# EAGLE design 03-LiDAR (EAGLE 9.6.2)

## Sheet 1 of 3
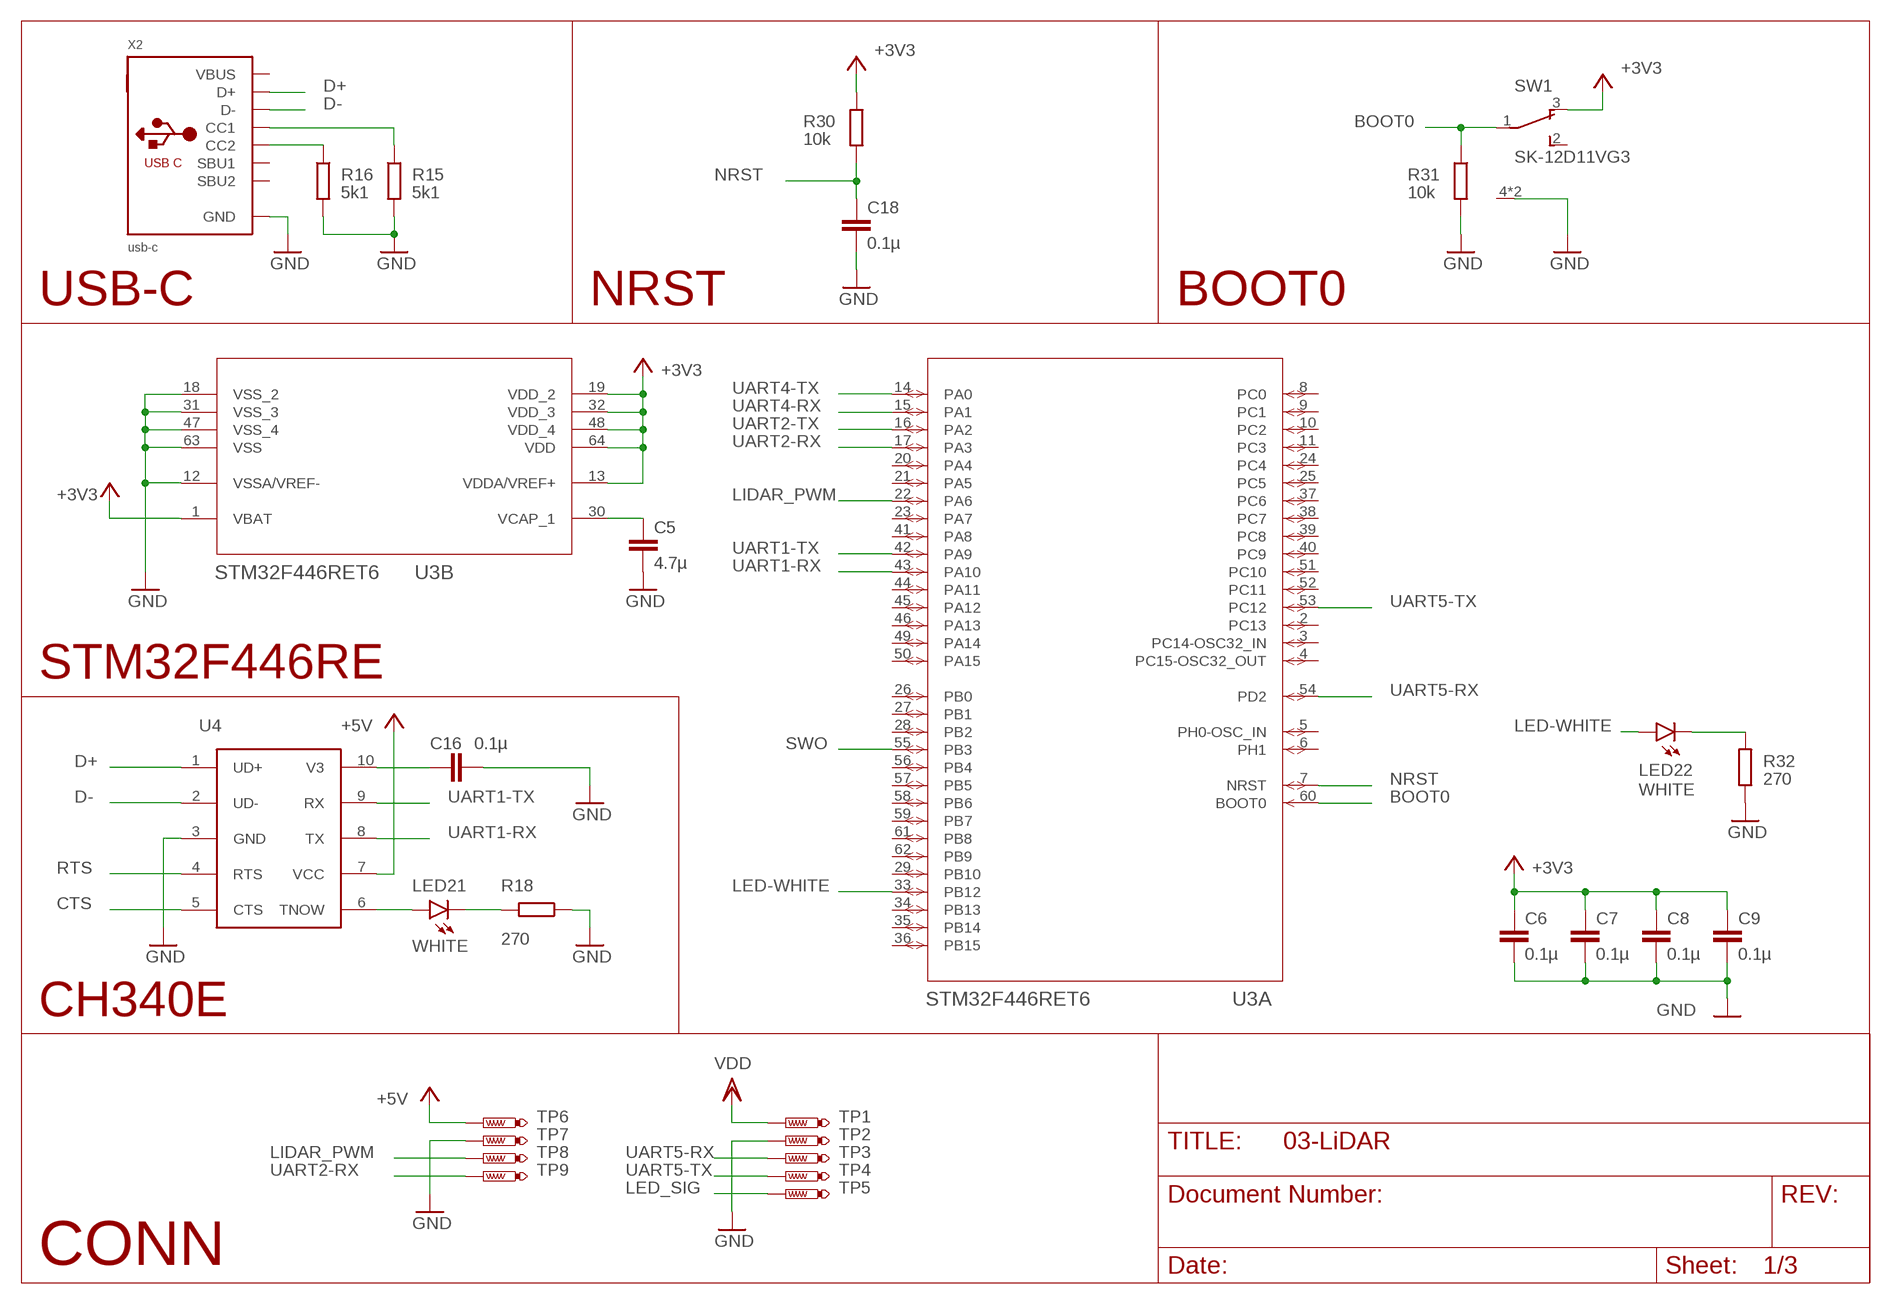
[diagram p0: schematic, sheet 1]

### Parts
C5  4.7µ  C-EUC0603  [C0603]
C6  0.1µ  C-EUC0603  [C0603]
C7  0.1µ  C-EUC0603  [C0603]
C8  0.1µ  C-EUC0603  [C0603]
C9  0.1µ  C-EUC0603  [C0603]
C16  0.1µ  C-EUC0603  [C0603]
C18  0.1µ  C-EUC0603  [C0603]
LED21  WHITE  LEDSML0603  [SML0603]
LED22  WHITE  LEDSML0603  [SML0603]
R15  5k1  R-EU_R0402  [R0402]
R16  5k1  R-EU_R0402  [R0402]
R18  270  R-EU_R0402  [R0402]
R30  10k  R-EU_R0402  [R0402]
R31  10k  R-EU_R0402  [R0402]
R32  270  R-EU_R0402  [R0402]
SW1  SK-12D11VG3  [SK-12D11VG3]
TP1  PTR1TP10R  [TP10R]
TP2  PTR1TP10SQ  [TP10SQ]
TP3  PTR1TP10R  [TP10R]
TP4  PTR1TP10R  [TP10R]
TP5  PTR1TP10R  [TP10R]
TP6  PTR1TP10R  [TP10R]
TP7  PTR1TP10SQ  [TP10SQ]
TP8  PTR1TP10R  [TP10R]
TP9  PTR1TP10R  [TP10R]
U3  STM32F446RET6  [LQFP64-10X10MM]
U4  CH340ESMD  [MSOP10]
X2  usb-c  USB_C  [USB_C_CUSB31-CFM2AX-01-X]

### Nets
+3V3 [PWR]: C6.1 C7.1 C8.1 C9.1 R30.1 SW1.3(O) U3.1(B:VBAT) U3.13(B:VDDA/VREF+) U3.19(B:VDD_2) U3.32(B:VDD_3) U3.48(B:VDD_4) U3.64(B:VDD) ; also sheet 2,3
+5V [PWR]: TP6.TP U4.7(VCC) ; also sheet 2,3
BOOT0: R31.1 SW1.1(P) U3.60(A:BOOT0)
CTS: U4.5(CTS)
D+: U4.1(UD+) X2.A6(D+) X2.B6(D+)
D-: U4.2(UD-) X2.A7(D-) X2.B7(D-)
GND [PWR]: C5.2 C6.2 C7.2 C8.2 C9.2 C16.2 C18.2 R15.2 R16.2 R18.1 R31.2 R32.1 SW1.4(CASE) SW1.5(CASE) TP2.TP TP7.TP U3.12(B:VSSA/VREF-) U3.18(B:VSS_2) U3.31(B:VSS_3) U3.47(B:VSS_4) U3.63(B:VSS) U4.3(GND) X2.A1B12(GND) X2.B1A12(GND) ; also sheet 2,3
LED-WHITE: LED22.A U3.33(A:PB12)
LED_SIG: TP5.TP ; also sheet 3
LIDAR_PWM: TP8.TP U3.22(A:PA6)
N$17: R15.1 X2.A5(CC1)
N$18: R16.1 X2.B5(CC2)
N$20: C5.1 U3.30(B:VCAP_1)
N$21: C16.1 U4.10(V3)
N$22: LED21.A U4.6(TNOW)
N$26: LED21.C R18.2
N$32: LED22.C R32.2
NRST: C18.1 R30.2 U3.7(A:NRST)
RTS: U4.4(RTS)
SWO: U3.55(A:PB3)
UART1-RX: U3.43(A:PA10) U4.8(TX)
UART1-TX: U3.42(A:PA9) U4.9(RX)
UART2-RX: TP9.TP U3.17(A:PA3)
UART2-TX: U3.16(A:PA2)
UART4-RX: U3.15(A:PA1) ; also sheet 2
UART4-TX: U3.14(A:PA0)
UART5-RX: TP3.TP U3.54(A:PD2) ; also sheet 2
UART5-TX: TP4.TP U3.53(A:PC12)
VDD [PWR]: TP1.TP ; also sheet 3
Unconnected: SW1.2(S) U3.2(A:PC13) U3.3(A:PC14-OSC32_IN) U3.4(A:PC15-OSC32_OUT) U3.5(A:PH0-OSC_IN) U3.6(A:PH1) U3.8(A:PC0) U3.9(A:PC1) U3.10(A:PC2) U3.11(A:PC3) U3.20(A:PA4) U3.21(A:PA5) U3.23(A:PA7) U3.24(A:PC4) U3.25(A:PC5) U3.26(A:PB0) U3.27(A:PB1) U3.28(A:PB2) U3.29(A:PB10) U3.34(A:PB13) U3.35(A:PB14) U3.36(A:PB15) U3.37(A:PC6) U3.38(A:PC7) U3.39(A:PC8) U3.40(A:PC9) U3.41(A:PA8) U3.44(A:PA11) U3.45(A:PA12) U3.46(A:PA13) U3.49(A:PA14) U3.50(A:PA15) U3.51(A:PC10) U3.52(A:PC11) U3.56(A:PB4) U3.57(A:PB5) U3.58(A:PB6) U3.59(A:PB7) U3.61(A:PB8) U3.62(A:PB9) X2.A8(SBU1) X2.B8(SBU2)

### Notes on the sheet
- USB-C | NRST | BOOT0
- STM32F446RE
- CH340E
- CONN

## Sheet 2 of 3
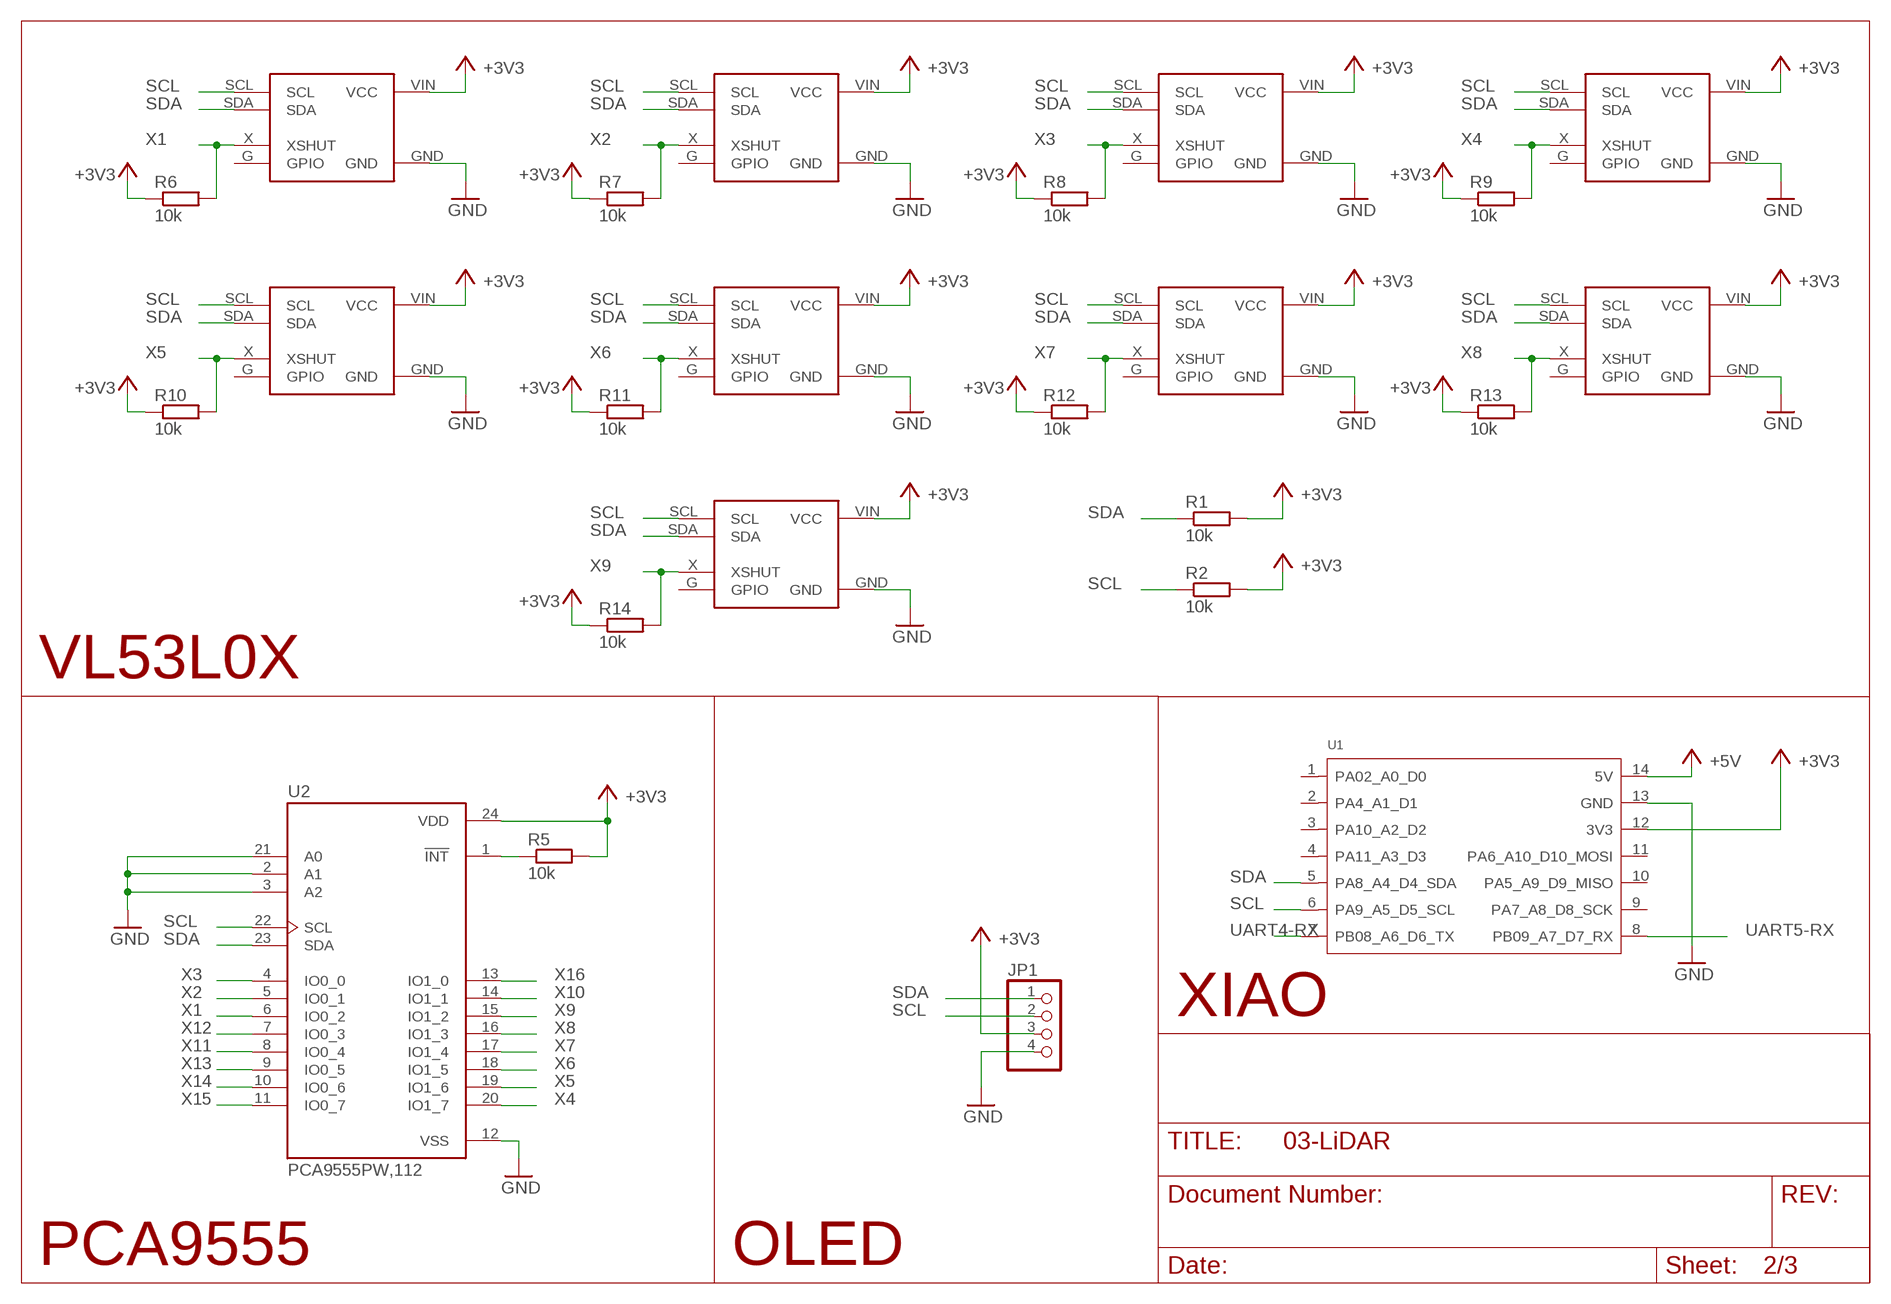
[diagram p1: schematic, sheet 2]

### Parts
JP1  PINHD-1X4  [1X04]
R1  10k  R-EU_R0402  [R0402]
R2  10k  R-EU_R0402  [R0402]
R5  10k  R-EU_R0402  [R0402]
R6  10k  R-EU_R0402  [R0402]
R7  10k  R-EU_R0402  [R0402]
R8  10k  R-EU_R0402  [R0402]
R9  10k  R-EU_R0402  [R0402]
R10  10k  R-EU_R0402  [R0402]
R11  10k  R-EU_R0402  [R0402]
R12  10k  R-EU_R0402  [R0402]
R13  10k  R-EU_R0402  [R0402]
R14  10k  R-EU_R0402  [R0402]
U1  MOUDLE-SEEEDUINO-XIAO  [MOUDLE14P-2.54-21X17.8MM]
U2  PCA9555PW,112  [SOP65P640X110-24N]
VL1  VL53L0X  [1X04]
VL2  VL53L0X  [1X04]
VL3  VL53L0X  [1X04]
VL4  VL53L0X  [1X04]
VL5  VL53L0X  [1X04]
VL6  VL53L0X  [1X04]
VL7  VL53L0X  [1X04]
VL8  VL53L0X  [1X04]
VL9  VL53L0X  [1X04]

### Nets
+3V3 [PWR]: JP1.3 R1.2 R2.2 R5.2 R6.1 R7.1 R8.1 R9.1 R10.1 R11.1 R12.1 R13.1 R14.1 U1.12(3V3) U2.24(VDD) VL1.VIN(VCC) VL2.VIN(VCC) VL3.VIN(VCC) VL4.VIN(VCC) VL5.VIN(VCC) VL6.VIN(VCC) VL7.VIN(VCC) VL8.VIN(VCC) VL9.VIN(VCC) ; also sheet 1,3
+5V [PWR]: U1.14(5V) ; also sheet 1,3
GND [PWR]: JP1.4 U1.13(GND) U2.2(A1) U2.3(A2) U2.12(VSS) U2.21(A0) VL1.GND VL2.GND VL3.GND VL4.GND VL5.GND VL6.GND VL7.GND VL8.GND VL9.GND ; also sheet 1,3
N$25: R5.1 U2.1(!INT)
SCL: JP1.2 R2.1 U1.6(PA9_A5_D5_SCL) U2.22(SCL) VL1.SCL VL2.SCL VL3.SCL VL4.SCL VL5.SCL VL6.SCL VL7.SCL VL8.SCL VL9.SCL
SDA: JP1.1 R1.1 U1.5(PA8_A4_D4_SDA) U2.23(SDA) VL1.SDA VL2.SDA VL3.SDA VL4.SDA VL5.SDA VL6.SDA VL7.SDA VL8.SDA VL9.SDA
UART4-RX: U1.7(PB08_A6_D6_TX) ; also sheet 1
UART5-RX: U1.8(PB09_A7_D7_RX) ; also sheet 1
X1 [XSHUT]: R6.2 U2.6(IO0_2) VL1.X(XSHUT)
X2 [XSHUT]: R7.2 U2.5(IO0_1) VL2.X(XSHUT)
X3 [XSHUT]: R8.2 U2.4(IO0_0) VL3.X(XSHUT)
X4 [XSHUT]: R9.2 U2.20(IO1_7) VL4.X(XSHUT)
X5 [XSHUT]: R10.2 U2.19(IO1_6) VL5.X(XSHUT)
X6 [XSHUT]: R11.2 U2.18(IO1_5) VL6.X(XSHUT)
X7 [XSHUT]: R12.2 U2.17(IO1_4) VL7.X(XSHUT)
X8 [XSHUT]: R13.2 U2.16(IO1_3) VL8.X(XSHUT)
X9 [XSHUT]: R14.2 U2.15(IO1_2) VL9.X(XSHUT)
X10 [XSHUT]: U2.14(IO1_1)
X11 [XSHUT]: U2.8(IO0_4)
X12 [XSHUT]: U2.7(IO0_3)
X13 [XSHUT]: U2.9(IO0_5)
X14 [XSHUT]: U2.10(IO0_6)
X15 [XSHUT]: U2.11(IO0_7)
X16 [XSHUT]: U2.13(IO1_0)
Unconnected: U1.1(PA02_A0_D0) U1.2(PA4_A1_D1) U1.3(PA10_A2_D2) U1.4(PA11_A3_D3) U1.9(PA7_A8_D8_SCK) U1.10(PA5_A9_D9_MISO) U1.11(PA6_A10_D10_MOSI) VL1.G(GPIO) VL2.G(GPIO) VL3.G(GPIO) VL4.G(GPIO) VL5.G(GPIO) VL6.G(GPIO) VL7.G(GPIO) VL8.G(GPIO) VL9.G(GPIO)

### Notes on the sheet
- VL53L0X
- XIAO
- PCA9555 | OLED

## Sheet 3 of 3
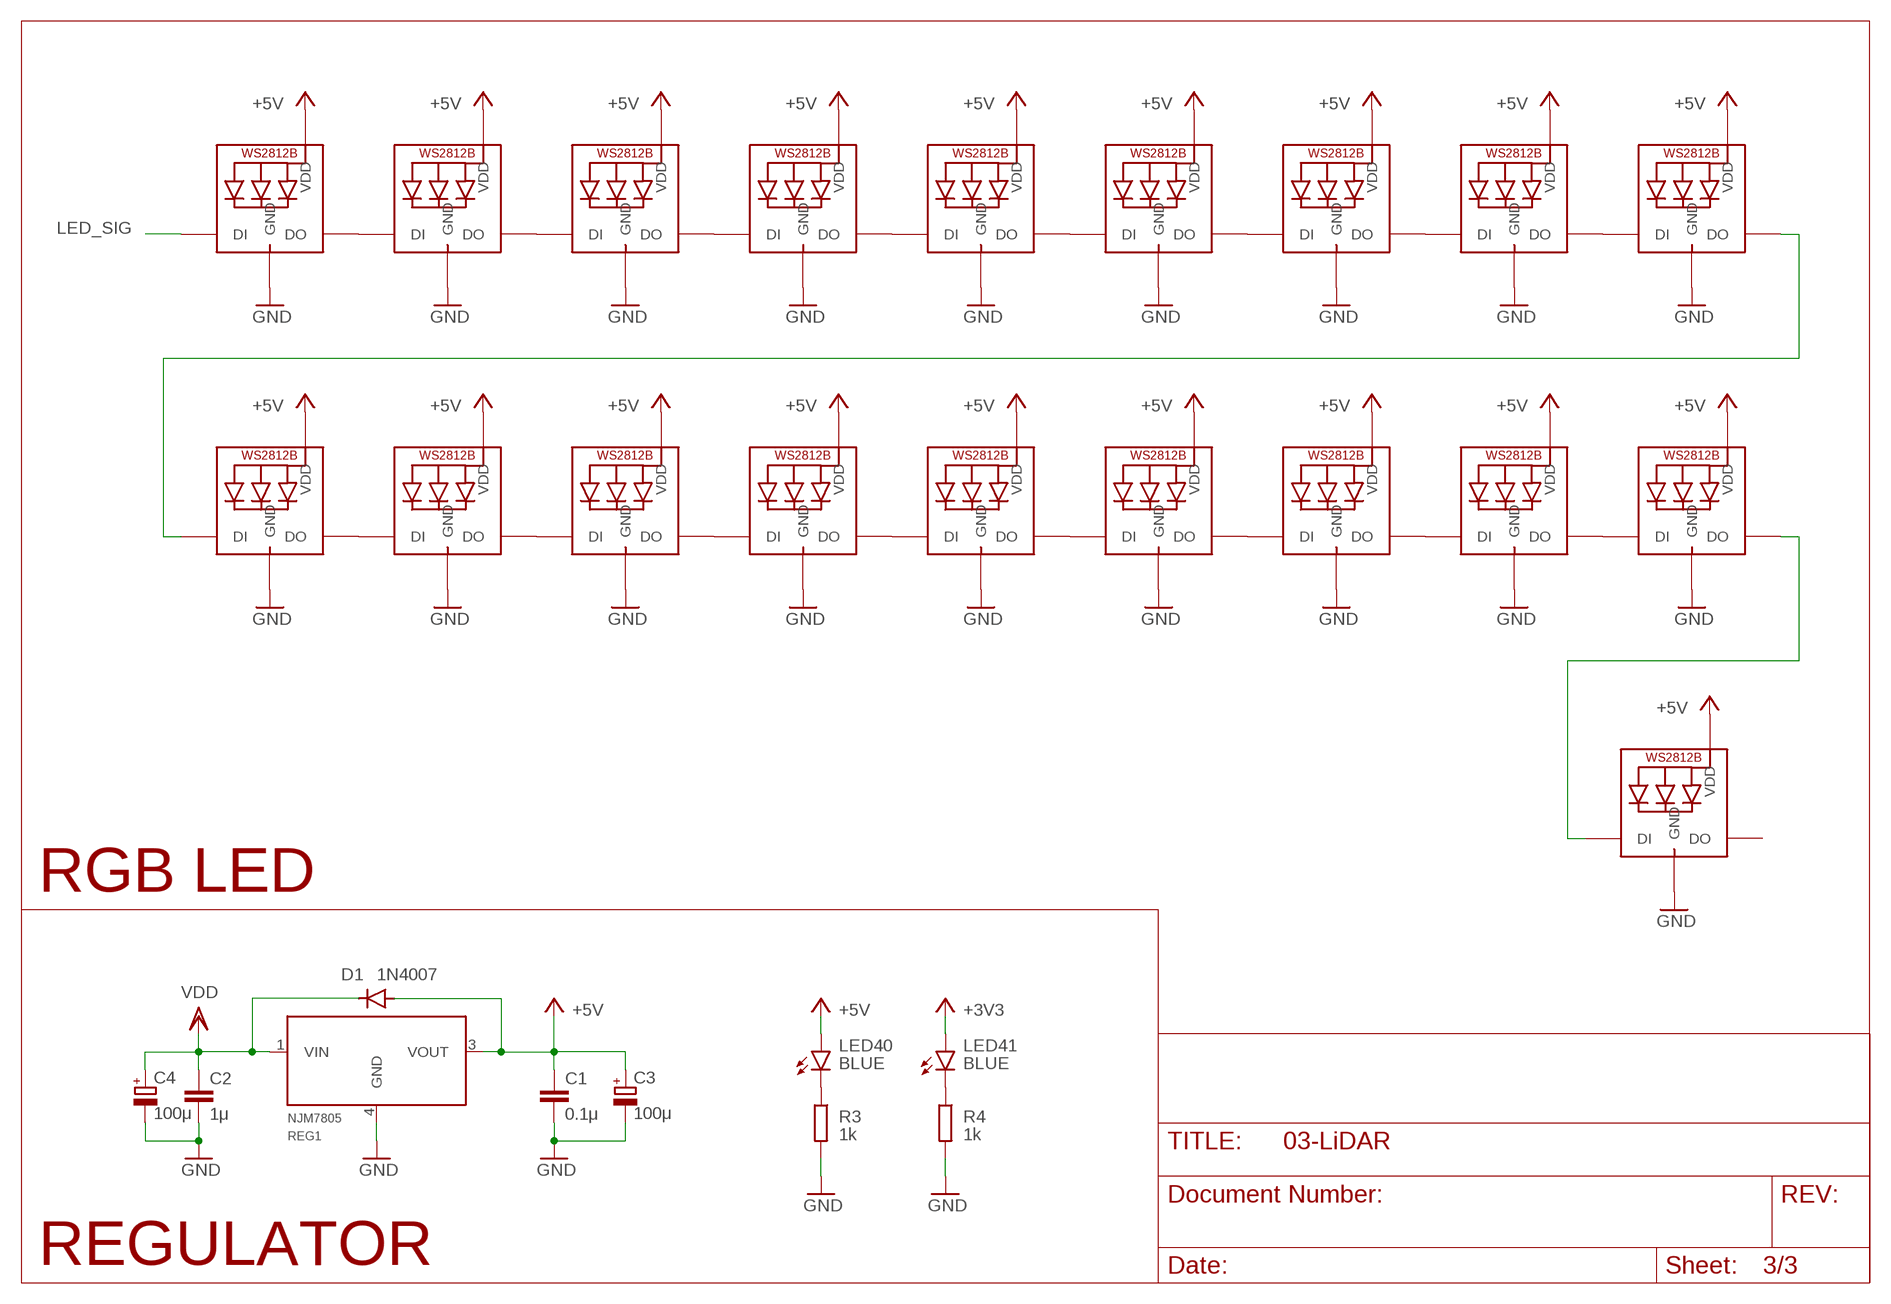
[diagram p2: schematic, sheet 3]

### Parts
C1  0.1μ  C-EUC0402  [C0402]
C2  1μ  C-EUC0402  [C0402]
C3  100μ  CPOL-EU153CLV-0505  [153CLV-0505]
C4  100μ  CPOL-EU153CLV-0505  [153CLV-0505]
D1  1N4007  GF1  [SMA-DO214AC]
LED1  WS2812B_5050N  [WS2812B-NARROW]
LED2  WS2812B_5050N  [WS2812B-NARROW]
LED3  WS2812B_5050N  [WS2812B-NARROW]
LED4  WS2812B_5050N  [WS2812B-NARROW]
LED5  WS2812B_5050N  [WS2812B-NARROW]
LED6  WS2812B_5050N  [WS2812B-NARROW]
LED7  WS2812B_5050N  [WS2812B-NARROW]
LED8  WS2812B_5050N  [WS2812B-NARROW]
LED9  WS2812B_5050N  [WS2812B-NARROW]
LED10  WS2812B_5050N  [WS2812B-NARROW]
LED11  WS2812B_5050N  [WS2812B-NARROW]
LED12  WS2812B_5050N  [WS2812B-NARROW]
LED13  WS2812B_5050N  [WS2812B-NARROW]
LED14  WS2812B_5050N  [WS2812B-NARROW]
LED15  WS2812B_5050N  [WS2812B-NARROW]
LED16  WS2812B_5050N  [WS2812B-NARROW]
LED17  WS2812B_5050N  [WS2812B-NARROW]
LED18  WS2812B_5050N  [WS2812B-NARROW]
LED19  WS2812B_5050N  [WS2812B-NARROW]
LED40  BLUE  LEDSML0603  [SML0603]
LED41  BLUE  LEDSML0603  [SML0603]
R3  1k  R-EU_R0402  [R0402]
R4  1k  R-EU_R0402  [R0402]
REG1  NJM7805  MYPARTS_NJM7800S-REGULATOR  [MYPARTS_D-PAK_TO252AA]

### Nets
+3V3 [PWR]: LED41.A ; also sheet 1,2
+5V [PWR]: C1.1 C3.+ D1.A LED1.1-VDD(VDD) LED2.1-VDD(VDD) LED3.1-VDD(VDD) LED4.1-VDD(VDD) LED5.1-VDD(VDD) LED6.1-VDD(VDD) LED7.1-VDD(VDD) LED8.1-VDD(VDD) LED9.1-VDD(VDD) LED10.1-VDD(VDD) LED11.1-VDD(VDD) LED12.1-VDD(VDD) LED13.1-VDD(VDD) LED14.1-VDD(VDD) LED15.1-VDD(VDD) LED16.1-VDD(VDD) LED17.1-VDD(VDD) LED18.1-VDD(VDD) LED19.1-VDD(VDD) LED40.A REG1.3(VOUT) ; also sheet 1,2
GND [PWR]: C1.2 C2.2 C3.- C4.- LED1.3-GND(GND) LED2.3-GND(GND) LED3.3-GND(GND) LED4.3-GND(GND) LED5.3-GND(GND) LED6.3-GND(GND) LED7.3-GND(GND) LED8.3-GND(GND) LED9.3-GND(GND) LED10.3-GND(GND) LED11.3-GND(GND) LED12.3-GND(GND) LED13.3-GND(GND) LED14.3-GND(GND) LED15.3-GND(GND) LED16.3-GND(GND) LED17.3-GND(GND) LED18.3-GND(GND) LED19.3-GND(GND) R3.2 R4.2 REG1.4(GND) ; also sheet 1,2
LED_SIG: LED1.4-DIN(DI) ; also sheet 1
N$1: LED1.2-DOUT(DO) LED2.4-DIN(DI)
N$2: LED2.2-DOUT(DO) LED3.4-DIN(DI)
N$3: LED3.2-DOUT(DO) LED4.4-DIN(DI)
N$4: LED4.2-DOUT(DO) LED5.4-DIN(DI)
N$5: LED5.2-DOUT(DO) LED6.4-DIN(DI)
N$6: LED6.2-DOUT(DO) LED7.4-DIN(DI)
N$7: LED7.2-DOUT(DO) LED8.4-DIN(DI)
N$8: LED8.2-DOUT(DO) LED9.4-DIN(DI)
N$9: LED10.2-DOUT(DO) LED11.4-DIN(DI)
N$10: LED11.2-DOUT(DO) LED12.4-DIN(DI)
N$11: LED12.2-DOUT(DO) LED13.4-DIN(DI)
N$12: LED13.2-DOUT(DO) LED14.4-DIN(DI)
N$13: LED14.2-DOUT(DO) LED15.4-DIN(DI)
N$14: LED15.2-DOUT(DO) LED16.4-DIN(DI)
N$15: LED16.2-DOUT(DO) LED17.4-DIN(DI)
N$16: LED17.2-DOUT(DO) LED18.4-DIN(DI)
N$23: LED40.C R3.1
N$24: LED41.C R4.1
N$28: LED9.2-DOUT(DO) LED10.4-DIN(DI)
N$33: LED18.2-DOUT(DO) LED19.4-DIN(DI)
VDD [PWR]: C2.1 C4.+ D1.K(C) REG1.1(VIN) ; also sheet 1
Unconnected: LED19.2-DOUT(DO)

### Notes on the sheet
- RGB LED
- REGULATOR

## Power pins joined to a net without a drawn wire
VBUS: X2.A4B9(VBUS) X2.B4A9(VBUS)

## Library data of the parts
C1 C2 C5-C9 C16 C18 = rcl:C-EU: CAPACITOR, European symbol; SPICEPREFIX: C
C3 C4 = rcl:CPOL-EU: POLARIZED CAPACITOR, European symbol; SPICEPREFIX: C
D1 = diode:GF1: DIODE
JP1 = pinhead:PINHD-1X4: PIN HEADER
LED1-LED19 = microbuilder:WS2812B
LED21 LED22 LED40 LED41 = led:LED: LED OSRAM: - CHIPLED LG R971, LG N971, LY N971, LG Q971, LY Q971, LO R971, LY R971 LH N974, LH R974 LS Q976, LO Q976, LY Q976 LO Q996 - Hyper CHIPLED LW Q18S LB Q993, LB Q99A, LB R99A - SideLED LS A670, LO A670, LY A670, LG A670, LP A670 LB A673, LV A673, LT A673, LW A673 LH A674 LY A675 LS A676, LA A676, LO A676, LY A676, LW A676 LS A679, LY A679, LG A679 - Hyper Micro SIDELED® LS Y876, LA Y876, LO Y876, LY Y876 LT Y87S - SmartLED LW L88C, LW L88S LB L89C, LB L89S, LG L890 LS L89K, LO L89K, LY L89K LS L896, LA L896, LO L896, LY L896 - TOPLED LS T670, LO T670, LY T670, LG T670, LP T670 LSG T670, LSP T670, LSY T670, LOP T670, LYG T670 LG T671, LOG T671, LSG T671 LB T673, LV T673, LT T673, LW T673 LH T674 LS T676, LA T676, LO T676, LY T676, LB T676, LH T676, LSB T676, LW T676 LB T67C, LV T67C, LT T67C, LS T67K, LO T67K, LY T67K, LW E67C LS E67B, LA E67B, LO E67B, LY E67B, LB E67C, LV E67C, LT E67C LW T67C LS T679, LY T679, LG T679 LS T770, LO T770, LY T770, LG T770, LP T770 LB T773, LV T773, LT T773, LW T773 LH T774 LS E675, LA E675, LY E675, LS T675 LS T776, LA T776, LO T776, LY T776, LB T776 LHGB T686 LT T68C, LB T68C - Hyper Mini TOPLED® LB M676 - Mini TOPLED Santana® LG M470 LS M47K, LO M47K, LY M47K Source: http://www.osram.convergy.de LUXEON: - LUMILED® LXK2-PW12-R00, LXK2-PW12-S00, LXK2-PW14-U00, LXK2-PW14-V00 LXK2-PM12-R00, LXK2-PM12-S00, LXK2-PM14-U00 LXK2-PE12-Q00, LXK2-PE12-R00, LXK2-PE12-S00, LXK2-PE14-T00, LXK2-PE14-U00 LXK2-PB12-K00, LXK2-PB12-L00, LXK2-PB12-M00, LXK2-PB14-N00, LXK2-PB14-P00, LXK2-PB14-Q00 LXK2-PR12-L00, LXK2-PR12-M00, LXK2-PR14-Q00, LXK2-PR14-R00 LXK2-PD12-Q00, LXK2-PD12-R00, LXK2-PD12-S00 LXK2-PH12-R00, LXK2-PH12-S00 LXK2-PL12-P00, LXK2-PL12-Q00, LXK2-PL12-R00 Source: www.luxeon.com KINGBRIGHT: KA-3528ASYC Source: www.kingbright.com
R1-R16 R18 R30-R32 = rcl:R-EU_: RESISTOR, European symbol; SPICEPREFIX: R
REG1 = #001-line:MYPARTS_NJM7800S-REGULATOR
SW1 = Slide Switch:SK-12D11VG3
TP1-TP9 = testpad:PTR1: TEST PIN
U1 = Seeeduino XIAO:MOUDLE-SEEEDUINO-XIAO
U2 = PCA9555PW_112:PCA9555PW,112: Check availability <https://pricing.snapeda.com/parts/PCA9555PW%2C112/NXP%20Semiconductors/view-part?ref=eda>; AVAILABILITY: In Stock; DESCRIPTION: Interface IC - I/O extensions NXP Semiconductors PCA9555PW, 112 POR I²C, SMBus 400 kHz TSSOP 24; MF: NXP Semiconductors; MP: PCA9555PW,112; PACKAGE: TSSOP-24 NXP Semiconductors; PRICE: None; PURCHASE-URL: https://pricing.snapeda.com/search/part/PCA9555PW,112/?ref=eda
U3 = F446RE:STM32F446RET6; COPYRIGHT: Copyright (C) 2022 Ultra Librarian. All rights reserved.; MANUFACTURER_PART_NUMBER: STM32F446RET6; MFR_NAME: STMicroelectronics
U4 = CH340E:CH340E: WCH.CN/CH340E See DataSheet： wch.cn <http://www.wch.cn/downloads/CH340DS1_PDF.html>
VL1-VL9 = VL53L0X:VL53L0X
X2 = microbuilder:USB_C: USB Type-C USB 2.0 Connector

## Net classes
0 default: width 0.254 mm
1 PWR: width 0.254 mm
2 XSHUT: width 0.254 mm

## Board
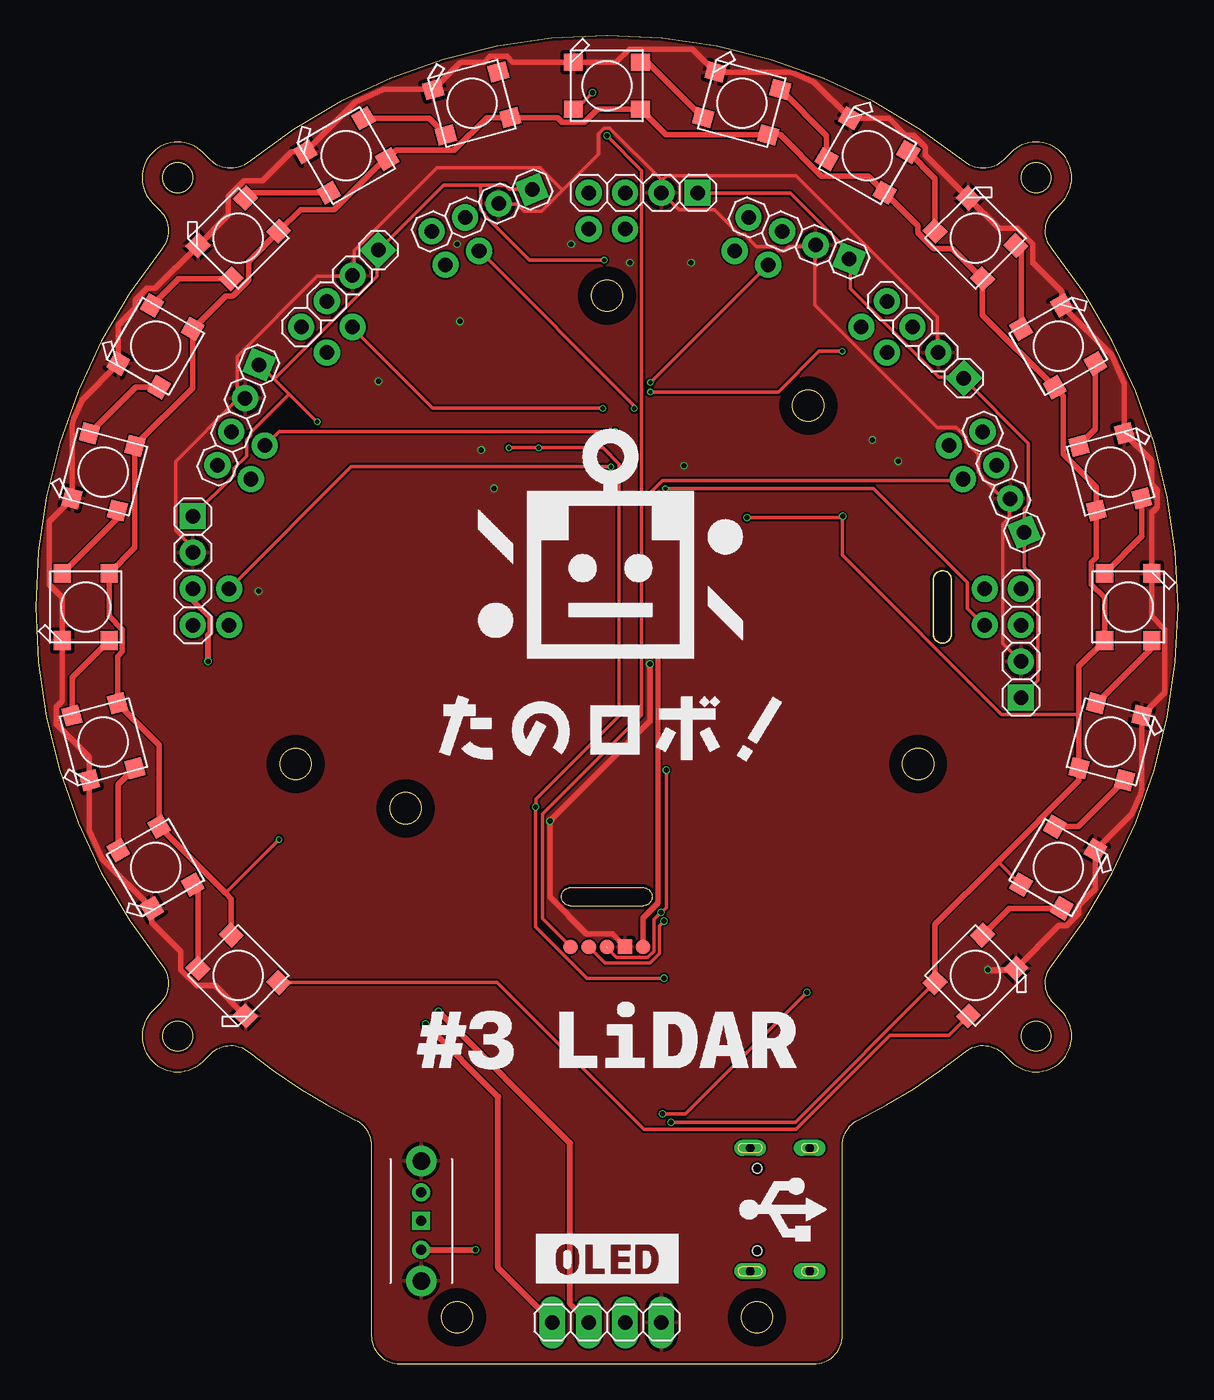
[diagram p3: board, top side]
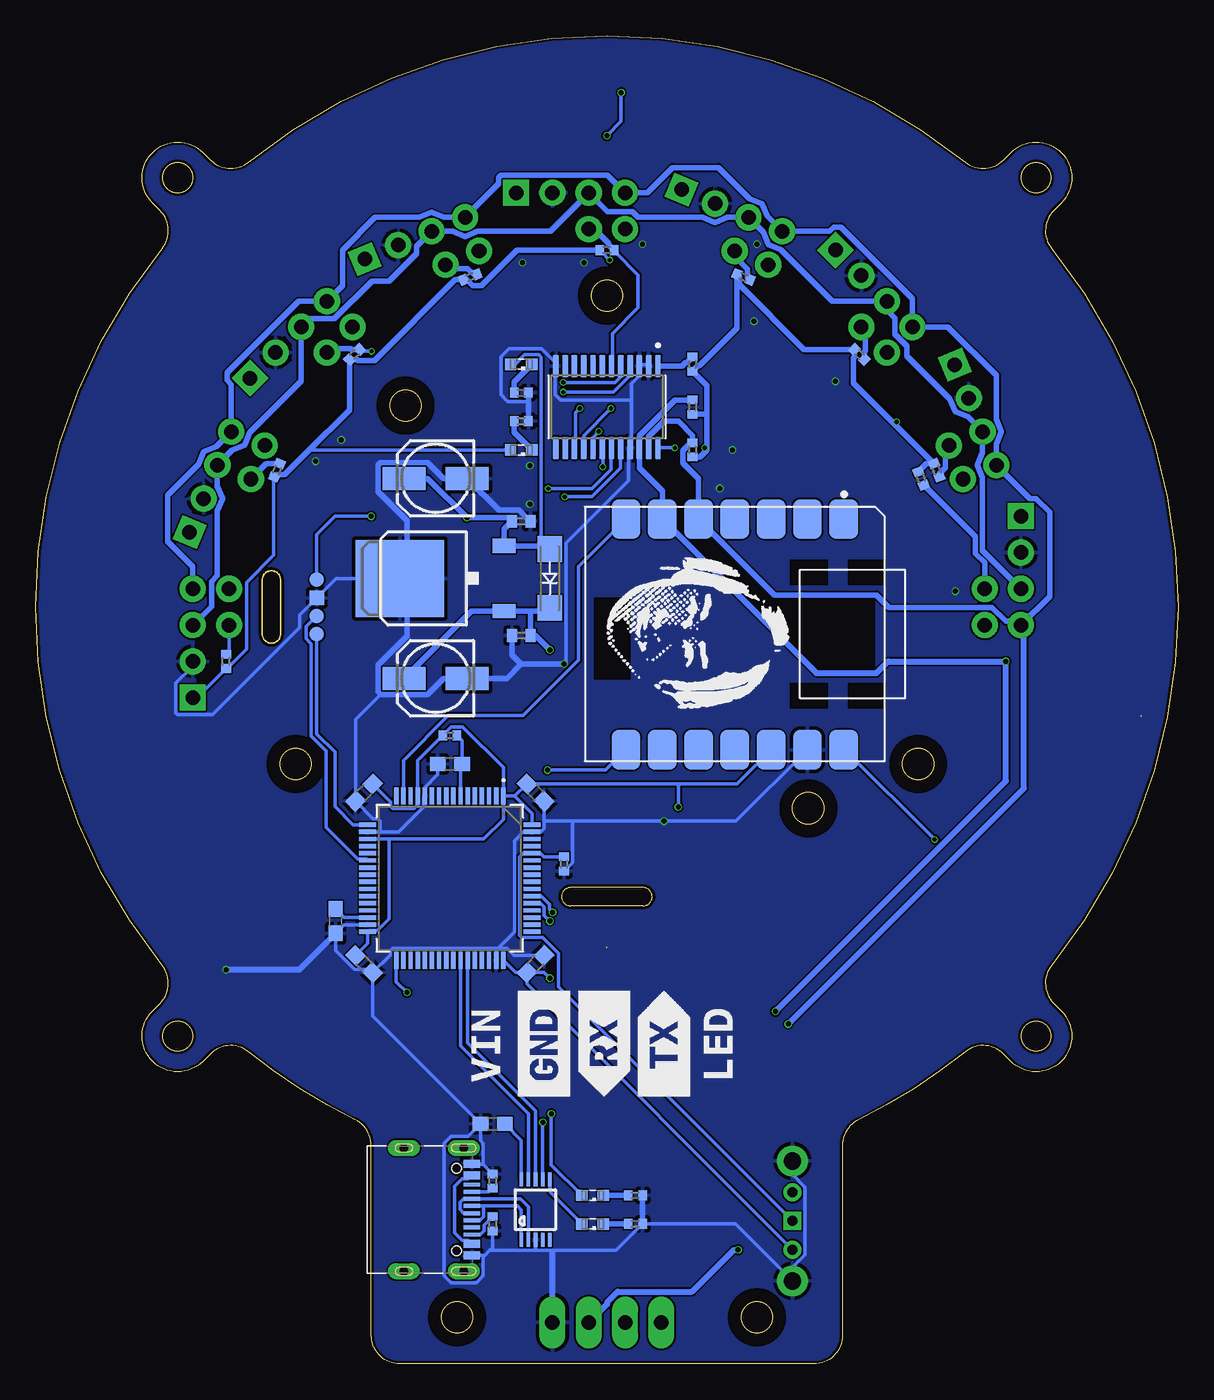
[diagram p4: board, bottom side, seen from below]

Size 80 x 93 mm. Coordinates in mm from the lower left corner, seen from the top.
Outline: 54.5,0 arc90 56.5,2 56.5,15.29 arc-64 57.62,17.09 arc13 65.09,21.85 arc-84 67.76,21.7 68.28,21.18 arc180 71.82,24.72 71.3,25.24 arc-84 71.15,27.91 arc78 71.15,78.09 arc-84 71.3,80.76 71.82,81.28 arc180 68.28,84.82 67.76,84.3 arc-84 65.09,84.15 arc78 14.91,84.15 arc-84 12.24,84.3 11.72,84.82 arc180 8.18,81.28 8.71,80.76 arc-84 8.85,78.09 arc78 8.85,27.91 arc-84 8.71,25.24 8.18,24.72 arc180 11.72,21.18 12.24,21.7 arc-84 14.91,21.85 arc13 22.38,17.09 arc-64 23.5,15.29 23.5,2 arc90 25.5,0 54.5,0
Outline: 37.46,33.34 42.54,33.34 arc-180 42.54,32.08 37.46,32.08 arc-180 37.46,33.34
Outline: 62.86,54.91 62.86,51.09 arc180 64.13,51.09 64.13,54.91 arc180 62.86,54.91
Outline: circle at 70.05,83.05 radius 1.05
Outline: circle at 9.95,83.05 radius 1.05
Outline: circle at 70.05,22.95 radius 1.05
Outline: circle at 9.95,22.95 radius 1.05
Outline: circle at 40,74.8 radius 1.1
Outline: circle at 18.21,42 radius 1.1
Outline: circle at 61.8,42 radius 1.1
Outline: circle at 54.1,67.1 radius 1.1
Outline: circle at 25.9,38.9 radius 1.1
Outline: circle at 29.5,3.25 radius 1.1
Outline: circle at 50.5,3.25 radius 1.1
Copper layers (1*16): Top 0.035mm / dielectric 1.6mm / Bottom 0.035mm
Design rules "jlcpcb-2layers *": minimum track width 5mil, minimum drill 0.3mm, track to track 5mil, track to pad 5mil, pad to pad 5mil, via to via 5mil, smd to smd 5mil, copper to edge 0.2mm, drill to drill 6mil, minimum pad ring 10mil, minimum via ring 3mil, stop-mask expansion 4mil, vias tented up to drill 15mil, thermal gap 10mil
tRestrict: area 38,72.8 to 42,76.8; area 16.2,40 to 20.2,44; area 59.8,40 to 63.8,44; area 52.1,65.1 to 56.1,69.1; area 23.9,36.9 to 27.9,40.9; area 48.5,1.2 to 52.5,5.2; area 27.5,1.2 to 31.5,5.2
bRestrict: area 38,72.8 to 42,76.8; area 16.2,40 to 20.2,44; area 59.8,40 to 63.8,44; area 52.1,65.1 to 56.1,69.1; area 23.9,36.9 to 27.9,40.9; area 48.5,1.2 to 52.5,5.2; area 27.5,1.2 to 31.5,5.2; 29 lines

### Footprints (pad centres in the part's own frame; a part is rotated, then mirrored left to right if it is on the bottom)
C0402 = smd 0.7 x 0.9: 1 -0.65,0; 2 0.65,0
153CLV-0505 = smd 3 x 1.6: + 2.2,0; - -2.2,0
C0603 = smd 1.1 x 1: 1 -0.85,0; 2 0.85,0
SMA-DO214AC = smd 1.8 x 1.7: A -2.05,0; K 2.05,0
1X04 = drill 1.016 long: 1 -3.81,0; 2 -1.27,0; 3 1.27,0; 4 3.81,0
WS2812B-NARROW = smd 1.3 x 1.2: 1-VDD 2.35,-1.65; 2-DOUT 2.35,1.65; 3-GND -2.35,1.65; 4-DIN -2.35,-1.65
SML0603 = smd 0.8 x 0.8: A 0.75,0; C -0.75,0
R0402 = smd 0.6 x 0.7: 1 -0.5,0; 2 0.5,0
MYPARTS_D-PAK_TO252AA = smd 1 x 1.6: 1 -2.28,-4.8; 3 2.28,-4.8 | smd 5.4 x 6.2: 4 0,2.5
SK-12D11VG3 = drill 0.7 square: 1 0,0 | drill 0.7: 2 -2,0; 3 2,0 | drill 1.2: 4 -4.2,0; 5 4.2,0
TP10R = smd 1 x 1: TP 0,0
TP10SQ = smd 1 x 1: TP 0,0
MOUDLE14P-2.54-21X17.8MM = smd 2.75 x 2: 1 0.835,18.12; 2 0.835,15.58; 3 0.835,13.04; 4 0.835,10.5; 5 0.835,7.96; 6 0.835,5.42; 7 0.835,2.88; 8 17,2.88; 9 17,5.42; 10 17,7.96; 11 17,10.5; 12 17,13.04; 13 17,15.58; 14 17,18.12
SOP65P640X110-24N = smd 1.57 x 0.41: 1 -2.87,3.575; 2 -2.87,2.925; 3 -2.87,2.275; 4 -2.87,1.625; 5 -2.87,0.975; 6 -2.87,0.325; 7 -2.87,-0.325; 8 -2.87,-0.975; 9 -2.87,-1.625; 10 -2.87,-2.275; 11 -2.87,-2.925; 12 -2.87,-3.575; 13 2.87,-3.575; 14 2.87,-2.925; 15 2.87,-2.275; 16 2.87,-1.625; 17 2.87,-0.975; 18 2.87,-0.325; 19 2.87,0.325; 20 2.87,0.975; 21 2.87,1.625; 22 2.87,2.275; 23 2.87,2.925; 24 2.87,3.575
LQFP64-10X10MM = smd 1.194 x 0.305: 1 -5.75,3.75; 2 -5.75,3.25; 3 -5.75,2.75; 4 -5.75,2.25; 5 -5.75,1.75; 6 -5.75,1.25; 7 -5.75,0.75; 8 -5.75,0.25; 9 -5.75,-0.25; 10 -5.75,-0.75; 11 -5.75,-1.25; 12 -5.75,-1.75; 13 -5.75,-2.25; 14 -5.75,-2.75; 15 -5.75,-3.25; 16 -5.75,-3.75; 33 5.75,-3.75; 34 5.75,-3.25; 35 5.75,-2.75; 36 5.75,-2.25; 37 5.75,-1.75; 38 5.75,-1.25; 39 5.75,-0.75; 40 5.75,-0.25; 41 5.75,0.25; 42 5.75,0.75; 43 5.75,1.25; 44 5.75,1.75; 45 5.75,2.25; 46 5.75,2.75; 47 5.75,3.25; 48 5.75,3.75 | smd 0.305 x 1.194: 17 -3.75,-5.75; 18 -3.25,-5.75; 19 -2.75,-5.75; 20 -2.25,-5.75; 21 -1.75,-5.75; 22 -1.25,-5.75; 23 -0.75,-5.75; 24 -0.25,-5.75; 25 0.25,-5.75; 26 0.75,-5.75; 27 1.25,-5.75; 28 1.75,-5.75; 29 2.25,-5.75; 30 2.75,-5.75; 31 3.25,-5.75; 32 3.75,-5.75; 49 3.75,5.75; 50 3.25,5.75; 51 2.75,5.75; 52 2.25,5.75; 53 1.75,5.75; 54 1.25,5.75; 55 0.75,5.75; 56 0.25,5.75; 57 -0.25,5.75; 58 -0.75,5.75; 59 -1.25,5.75; 60 -1.75,5.75; 61 -2.25,5.75; 62 -2.75,5.75; 63 -3.25,5.75; 64 -3.75,5.75
MSOP10 = smd 1 x 0.25: 1 -2.113,1; 2 -2.113,0.5; 3 -2.113,0; 4 -2.113,-0.5; 5 -2.113,-1; 6 2.113,-1; 7 2.113,-0.5; 8 2.113,0; 9 2.113,0.5; 10 2.113,1
1X04' = drill 1.016: G -1.27,-2.54; GND 3.81,0; SCL 1.27,0; SDA -1.27,0; X 1.27,-2.54 | drill 1.016 square: VIN 6.35,0
USB_C_CUSB31-CFM2AX-01-X = smd 0.575 x 1.15: A1B12 -3.2,3.545; A4B9 -2.4,3.545; B1A12 3.2,3.545; B4A9 2.4,3.545 | smd 0.275 x 1.15: A5 -1.25,3.545; A6 -0.25,3.545; A7 0.25,3.545; A8 1.25,3.545; B5 1.75,3.545; B6 0.75,3.545; B7 -0.75,3.545; B8 -1.75,3.545 | drill 0.6 pad 1 long: M1 -4.32,2.97; M2 4.32,2.97; M3 -4.32,-1.21; M4 4.32,-1.21 | hole 0.65: 2.89,2.47; -2.89,2.47

### Placement (x,y rotation side)
C1  46,59 0 bottom
C2  46,51 180 bottom
C3  52,62 180 bottom
C4  52,48 180 bottom
C5  59,31 270 bottom
C6  57,40 225 bottom
C7  57,28 315 bottom
C8  45,40 315 bottom
C9  45,28 45 bottom
C16  48,16.8 180 bottom
C18  51,42 180 bottom
D1  44,55 270 bottom
JP1  40,2.9 0 top
LED1  40,89.5 0 top
LED2  49.45,88.26 345 top
LED3  58.25,84.61 330 top
LED4  65.81,78.81 315 top
LED5  71.61,71.25 300 top
LED6  75.26,62.45 285 top
LED7  76.5,53 270 top
LED8  75.26,43.55 255 top
LED9  71.61,34.75 240 top
LED10  65.81,27.19 225 top
LED11  14.19,27.19 135 top
LED12  8.39,34.75 120 top
LED13  4.74,43.55 105 top
LED14  3.5,53 90 top
LED15  4.74,62.45 75 top
LED16  8.39,71.25 60 top
LED17  14.19,78.81 45 top
LED18  21.75,84.61 30 top
LED19  30.55,88.26 15 top
LED21  41,9.8 180 bottom
LED22  41,11.8 180 bottom
LED40  46,70 180 bottom
LED41  46,64 180 bottom
R1  34,64 270 bottom
R2  34,67 270 bottom
R3  46,68 0 bottom
R4  46,66 0 bottom
R5  34,70 270 bottom
R6  40,78 0 bottom
R7  49.57,76.1 22.5 bottom
R8  57.68,70.68 45 bottom
R9  63.1,62.57 67.5 bottom
R10  66.67,49.19 90 bottom
R11  18,62 292.5 bottom
R12  16.9,62.57 292.5 bottom
R13  22.32,70.68 315 bottom
R14  30.43,76.1 337.5 bottom
R15  48,12.8 90 bottom
R16  48,9.8 270 bottom
R18  38,9.8 180 bottom
R30  51,44 0 bottom
R31  43,35 270 bottom
R32  38,11.8 180 bottom
REG1  52,55 90 bottom
SW1  27,10 270 top
TP1  42.54,29.2 0 top
TP2  41.27,29.2 0 top
TP3  40,29.2 0 top
TP4  38.73,29.2 0 top
TP5  37.46,29.2 0 top
TP6  60.32,54.91 0 bottom
TP7  60.32,53.63 0 bottom
TP8  60.32,52.37 0 bottom
TP9  60.32,51.09 0 bottom
U1  41.54,60 270 bottom
U2  40,67 270 bottom
U3  51,34 270 bottom
U4  45,10.8 90 bottom
VL1  VL53L0X  [1X04']  40,82 0 top
VL2  VL53L0X  [1X04']  51.1,79.79 337.5 top
VL3  VL53L0X  [1X04']  60.51,73.51 315 top
VL4  VL53L0X  [1X04']  66.79,64.1 292.5 top
VL5  VL53L0X  [1X04']  69,53 270 top
VL6  VL53L0X  [1X04']  11,53 90 top
VL7  VL53L0X  [1X04']  13.21,64.1 67.5 top
VL8  VL53L0X  [1X04']  19.49,73.51 45 top
VL9  VL53L0X  [1X04']  28.9,79.79 22.5 top
X2  53,10.8 270 bottom

### Tracks (layer width: path | path; a pad name or v marks a point on that pad's centre or on a via)
+3V3  (via drill 0.3, 0.35)
  Top 0.254: v44,27 38.6,27 35,30.6 v35,39 35.05,39.09 35.05,39.57 40.86,45.38 40.86,63 39.71,64.14 v35.24,64.14 v33.14,64.14 | 16.71,68.95 15.71,69.95 VL7.VIN | 16.71,68.95 17.76,67.91 | 17.76,67.91 v19.71,65.95 | 17.76,67.91 15.04,65.19 15.04,65 14.76,64.72 14.76,63.57 13.9,62.72 13.9,62.24 11.04,59.38 VL6.VIN | 16.71,68.95 23.9,76.15 23.9,77.96 VL8.VIN 24.09,78.05 28.57,82.53 31.14,82.53 | 31.14,82.53 32.86,82.53 33.14,82.24 34.76,82.24 VL9.VIN | VL5.VIN 69.05,46.71 70.19,47.86 70.19,54.81 69.24,55.76 69.24,58.14 VL4.VIN 69.24,58.33 69.24,59.86 69.53,60.14 69.53,64.43 65.05,68.91 VL3.VIN 64.96,69.1 63.24,69.1 57.05,75.29 57.05,77.29 VL2.VIN 56.95,77.48 56.95,77.86 52.86,81.96 46.38,81.96 VL1.VIN | 31.14,82.53 31.14,80.81 31.43,80.53 31.43,80.43 34.57,77.29 v39.81,77.29
  Top 0.406: SW1.3 30.79,8 v30.81,7.98
  Bottom 0.254: 46.45,39.75 C8.1 35,40.6 | 46.45,39.75 U3.1 | U3.64 45.25,38.55 46.45,39.75 | C9.1 46.4,27.4 U3.48 | C7.1 56.75,29.45 U3.32 56.66,30.34 56.05,30.34 55.24,31.15 55.24,36.75 | SW1.3 45.6,26.6 C9.1 | U1.12 30.9,40.6 35,40.6 | U3.1 47.25,41.76 50.1,44.6 50.91,44.6 51.05,44.45 R30.1 53.25,42.25 U3.13 53.25,39.14 53.49,38.9 55.01,38.9 55.16,39.05 55.16,39.36 C6.1 | 35,40.6 v35,39 | v44,27 44.4,27.4 C9.1 | U3.19 55.24,36.75 | 55.24,36.75 48.63,36.75 47.25,38.13 U3.1 | LED41.A 60.83,64 61,63.84 | VL5.VIN 68.71,46.65 R10.1 66.58,48.71 65.24,50.05 65.24,54.71 63.34,56.62 63.34,61.95 R9.1 | v35.24,64.14 36.38,64.14 U2.24 | v33.14,64.14 33,64.14 | v19.71,65.95 19.71,65.86 19.82,65.75 | v39.81,77.29 40.38,77.86 R6.1
  Bottom 0.381: 33,66.5 33,68.5 R5.2 33.62,69.88 33.52,69.88 30.9,72.51 R14.1 30.73,76.12 30.73,75.56 26.2,71.03 R13.1 22.68,70.49 22.75,70.42 22.75,68.68 19.82,65.75 R12.1 17.62,63.03 R11.1 | 33,66.5 33,64.14 33,64 33.5,63.5 R1.2 | R2.2 33,66.5 | R9.1 63.12,62.27 62.56,62.27 61,63.84 58.03,66.8 R8.1 57.49,70.32 57.42,70.25 56.28,70.25 50.63,75.91 R7.1 49.79,75.91 49.39,75.51 48.78,75.51 46.29,78 R6.1
  Bottom 0.406: JP1.3 39.98,4.2 39.98,4.33 39.25,5.06 34.03,5.06 31.11,7.98 v30.81,7.98
+5V  (via drill 0.3, 0.35)
  Top 0.254: v44.49,16.91 53.2,16.91 LED10.1-VDD 63.05,26.71 LED10.1-VDD | v49.81,59.26 56.42,59.26 v56.51,59.35 56.48,59.19 56.48,56.62 67.62,45.48 73.05,45.48 | 5.73,46.33 5.81,46.33 LED13.1-VDD | LED11.1-VDD 13.71,30.05 13.7,30.05 | LED9.1-VDD 68.96,33.57 67.43,35.09 67.37,35.16 | LED12.1-VDD 8.66,37.66 8.64,37.66 | LED8.1-VDD 73.05,41.76 | 13.29,32.96 v17.05,36.71
  Top 0.381: LED13.1-VDD 5.73,46.33 5.73,49.53 6.07,49.87 6.07,51.43 5.15,52.35 LED14.1-VDD 6.95,57.15 LED15.1-VDD 10.99,68.34 LED16.1-VDD 13.31,74.78 13.79,74.78 14.9,75.89 14.9,77.18 LED17.1-VDD 18.54,80.82 20.89,80.82 24.43,84.36 LED18.1-VDD 25.22,84.97 29.3,84.97 31.6,87.27 LED19.1-VDD 36.53,87.27 36.87,86.93 38.43,86.93 39.35,87.85 LED1.1-VDD 44.15,86.05 LED2.1-VDD 52.15,86.05 55.04,83.17 58.3,83.17 LED3.1-VDD 61.78,79.69 61.78,79.21 62.89,78.1 64.18,78.1 LED4.1-VDD 66.3,73.44 LED5.1-VDD 71.97,67.78 71.97,63.7 74.27,61.4 LED6.1-VDD 74.27,56.47 73.93,56.13 73.93,54.57 74.85,53.65 LED7.1-VDD 73.05,48.85 73.05,45.48 73.05,41.76 LED8.1-VDD 73.05,40.85 67.37,35.16 62.98,30.77 LED10.1-VDD | LED13.1-VDD | LED13.1-VDD 8.64,43.34 8.64,37.66 LED12.1-VDD | LED12.1-VDD | LED12.1-VDD 13.29,32.96 13.7,32.56 13.7,30.05 LED11.1-VDD | LED11.1-VDD | LED10.1-VDD
  Bottom 0.254: U4.7 v44.5,16.9 v44.49,16.91 | LED40.A 46.41,70 45.76,70.65 44.75,70.65 44.6,70.5 44.6,57.65 44.23,57.28 | TP6.TP 60.32,58.08 59.05,59.35 v56.51,59.35 | v17.05,36.71 23.33,43 U1.14
  Bottom 0.381: C3.+ 52.55,62 v49.81,59.26 46.91,59.26 C1.1 47.2,58.45 REG1.3 44.23,57.28 D1.A
BOOT0
  Bottom 0.254: SW1.1 43.4,26.4 43.4,28.74 44.5,29.84 45.95,29.84 46.1,29.99 46.1,35.51 45.86,35.75 U3.60 44.64,35.75 44.39,35.5 R31.1
D+
  Bottom 0.254: 48.88,11.05 X2.A6 48.63,11.05 | 48.63,11.05 46.25,11.05 46,10.8 U4.1 | X2.B6 48.88,10.05 48.63,10.31 48.63,11.05
D-
  Bottom 0.254: U4.2 45.5,11.01 46.04,11.55 X2.B7 50.03,11.55 50.28,11.29 50.28,10.81 50.03,10.55 X2.A7
GND  (via drill 0.35)
  Top 0.254: TP2.TP 41,29.48 | VL6.GND 10.95,56.81 10.95,57.19 9.81,58.33 9.81,63.19 14.19,67.57 14.66,67.57 VL7.GND 14.09,67.57 14.09,70.53 19.71,76.15 22.09,76.15 VL8.GND 22.28,76.24 22.28,77.96 28.09,83.77 35.33,83.77 36.9,82.19 | 36.9,82.19 39.43,84.72 39.43,86.15 39.81,86.53 40.19,86.53 43.81,82.91 VL1.GND | 36.9,82.19 35.43,80.72 34.19,80.72 33.71,81.19 32.48,81.19 VL9.GND | VL3.GND 63.15,70.91 63.15,73.29 53.24,83.19 44.19,83.19 43.91,82.91 VL1.GND | VL1.GND 43.91,81.96 45.05,80.81 47.53,80.81 49.24,79.1 49.62,79.1 50.48,78.24 51.72,78.24 52,77.96 52.48,77.96 52.76,78.24 54.57,78.24 VL2.GND 54.57,78.15 54.57,74.14 63.15,65.57 64.48,65.57 65.15,64.91 65.15,64.53 66,63.67 66,62.43 66.29,62.14 66.29,62.05 67.81,60.52 68.1,60.52 VL4.GND 68.19,60.52 68.19,59.29 67.72,58.81 67.72,50.43 68.96,49.19 VL5.GND | LED12.3-GND 8.09,31.95 8.08,31.94 | 3.76,40.81 3.81,40.81 LED13.3-GND | LED11.3-GND 14.66,24.43 14.64,24.41 | LED9.3-GND 74.29,36.05 74.3,36.04 | 77.43,45.38 LED8.3-GND | LED10.3-GND 68.67,27.76 68.69,27.74
  Top 0.381: LED12.3-GND 8.14,30.91 10.16,28.89 10.16,27.59 11.27,26.48 12.56,26.48 14.64,24.41 LED11.3-GND | LED11.3-GND | LED12.3-GND | LED12.3-GND 8.08,31.94 4.66,35.37 3.76,37.36 3.76,40.81 LED13.3-GND 3.76,42.5 1.45,44.81 1.45,46.01 1.85,46.41 LED14.3-GND 1.85,53.65 0.93,54.57 0.93,58.99 LED15.3-GND 2.54,65.77 2.65,66.17 3.24,67.5 LED16.3-GND 5.79,72.74 6.97,73.92 6.97,74.48 7.8,75.31 8.36,75.31 LED17.3-GND 13.48,80.44 13.48,81.73 14.59,82.84 15.89,82.84 17.91,84.86 LED18.3-GND 22.37,88.34 24.36,89.24 LED19.3-GND 29.72,91.11 29.89,91.15 31.43,91.15 31.83,91.55 33.01,91.55 33.41,91.15 LED1.3-GND 40.65,91.15 41.57,92.07 46,92.07 LED2.3-GND 52.77,90.46 53.17,90.35 54.5,89.76 LED3.3-GND 59.74,87.21 60.92,86.03 61.48,86.03 62.31,85.2 62.31,84.64 LED4.3-GND 67.44,79.52 68.73,79.52 69.84,78.41 69.84,77.11 71.86,75.09 LED5.3-GND 75.34,70.63 76.24,68.64 LED6.3-GND 78.11,63.28 78.15,63.11 78.15,61.57 78.55,61.17 78.55,59.99 78.15,59.59 LED7.3-GND 78.15,52.35 79.07,51.43 79.07,47.01 LED8.3-GND | LED8.3-GND | LED8.3-GND 77.46,40.23 77.36,39.83 76.76,38.5 74.3,36.04 LED9.3-GND | LED9.3-GND | LED9.3-GND 74.21,33.26 73.03,32.08 73.03,31.52 72.2,30.69 71.64,30.69 68.69,27.74 LED10.3-GND | LED10.3-GND | TP2.TP 40.38,30.1 38.58,30.1 36,32.68 v36,38 43,45 v43,49
  Top 0.406: v66.67,27.6 68.55,27.6 LED10.3-GND
  Bottom 0.254: C16.2 48.85,15.64 48.67,15.45 48.67,13.97 | 48.67,13.97 R15.2 | X2.A1B12 49.42,13.97 48.67,13.97 | R16.2 48,8.13 48.2,7.93 | 48.2,7.93 48.53,7.6 48.67,7.6 | C16.2 49.72,15.93 50.92,15.93 51.39,15.45 51.39,6.15 50.92,5.67 49.14,5.67 48.67,6.15 48.67,7.6 | 48.67,7.6 X2.B1A12 | U4.3 45,7.93 | 43.81,7.93 39.36,7.93 37.95,9.34 37.95,9.35 R18.1 31,9.8 SW1.5 27,6.75 26.12,7.63 26.12,12.37 27,13.25 SW1.4 | 43.81,7.93 45,7.93 | 48.2,7.93 45,7.93 | C8.2 44.4,38 | 44.4,38 44.4,37.49 44.64,37.25 U3.63 45.86,37.25 46.48,36.63 46.48,30.24 47.62,29.1 | C18.2 51.85,41.26 52.75,40.36 U3.12 52.84,39.66 52.84,39.01 54.6,37.25 55.9,37.25 | 47.51,29.1 46.99,29.1 46.49,28.6 C9.2 | 47.51,29.1 47.75,28.86 U3.47 | U3.31 58.4,30.75 C5.2 59,28.93 57.67,27.61 56.61,27.61 C7.2 | C16.2 56.4,24.35 C7.2 | 47.51,29.1 47.62,29.1 | 55.9,37.25 55.9,38.01 56.05,38.16 56.36,38.16 C6.2 57.6,45.11 55.83,46.88 | 56.14,37.25 U3.18 55.9,37.25 | U1.13 30.96,38 v36,38 42.49,38 | 44.4,38 42.49,38 | R31.2 42.55,34.95 42.4,35.09 42.4,37.91 42.49,38 | C7.2 55.16,28.64 55.16,28.95 55.01,29.1 47.62,29.1 | 45.5,67.38 46.95,67.38 47.43,67.86 47.43,70.53 46.86,71.1 44.57,71.1 43.62,70.14 43.62,69.95 U2.12 43.62,69.76 43.62,67.86 43.24,67.48 38.29,67.48 | U2.2 37.14,69.95 37.71,69.95 U2.3 37.71,69.76 37.71,69.19 38.29,68.62 38.29,67.48 | 38.29,67.48 38.29,64.14 U2.21 38.48,64.05 38.48,61.86 42.86,57.48 42.86,49.09 v43,49 | 43.81,7.85 43.81,7.93 | 54,55 54.38,55 REG1.4 58.96,55 TP7.TP 61.53,52.43 61.53,51.57 67.62,45.48 70.1,45.48 70.19,45.57 70.19,47.67 69.05,48.81 69.05,49.19 VL5.GND
  Bottom 0.381: R3.2 45.5,67.38 R4.2 | C1.2 45.4,59 46.17,59.77 47.57,59.77 C3.- 51.45,62 52.57,63.12 55.83,63.12 56.02,62.93 56.02,61.07 54,59.05 54,55 54,50.95 56.02,48.93 56.02,47.07 55.83,46.88 52.57,46.88 51.45,48 C4.- 47,48 46,49 | 46.8,51 C2.2 46.65,49.65 46,49 | R18.1 R32.1 | v43,49 46,49
  Bottom 0.406: JP1.4 43.81,7.85 43.81,7.86 | C5.2 61.55,27.6 v66.67,27.6
  other vias: 29.5,78.4 37.5,78.4 41.6,77.1 45.9,77.1 58.6,64.7 60.4,63.2 45.4,60.2 45.4,62.9 29.7,73 15.6,54.1 32.1,61.3 31.2,64 24,68.8
  pour Top: 0,93 80,93 80,-7 0,-7
  pour Bottom: 0,93 80,93 80,-7 0,-7
LED-WHITE  (via drill 0.35)
  Top 0.254: v43.9,17.5 45.5,17.5 v54,26
  Bottom 0.254: LED22.A 43.9,13.95 v43.9,17.49 v43.9,17.5 | U3.33 54.75,26.75 v54,26
LED_SIG  (via drill 0.35)
  Top 0.254: v40,86 42.44,83.56 42.44,45.44 35.5,38.49 35.5,31.18 TP5.TP | v39,89 37.85,87.85 LED1.4-DIN
  Bottom 0.254: v40,86 39,87 v39,89
LIDAR_PWM
  Bottom 0.254: U3.22 56.84,35.34 57.45,35.34 59.67,37.56 59.67,42.92 60.7,43.95 60.7,50.41 61.07,50.78 61.07,51.61 TP8.TP
N$1
  Top 0.254: LED2.4-DIN 46.76,87.29 46.74,87.26
  Top 0.381: LED1.2-DOUT 42.85,91.15 46.74,87.26 47,87
N$2
  Top 0.381: LED2.2-DOUT 55.39,86 LED3.4-DIN
N$3
  Top 0.381: LED3.2-DOUT 62.98,82.99 LED4.4-DIN
N$4
  Top 0.381: LED4.2-DOUT 69.01,77.95 LED5.4-DIN
N$5
  Top 0.381: LED5.2-DOUT 74.21,65.45 LED6.4-DIN
N$6
  Top 0.381: LED6.2-DOUT 77.46,57.96 LED7.4-DIN
N$7
  Top 0.254: LED8.4-DIN 74.29,46.24 LED8.4-DIN
  Top 0.381: LED7.2-DOUT 78.15,50.13 LED8.4-DIN | LED8.4-DIN
N$8
  Top 0.254: LED9.4-DIN 71.43,37.66 71.43,37.61 | 76.19,40.81 76.2,40.81 LED8.2-DOUT
  Top 0.381: LED8.2-DOUT | LED8.2-DOUT 76.19,40.81 73,37.61 71.43,37.61 LED9.4-DIN | LED9.4-DIN
N$9
  Top 0.254: LED10.2-DOUT 63.95,23 59.82,23 53.23,16.41 42.59,16.41 32.3,26.7 LED11.4-DIN
N$10
  Top 0.254: LED12.4-DIN 11.04,33.57 11,33.53 | 11.36,27.76 11.43,27.76 LED11.2-DOUT
  Top 0.381: LED11.2-DOUT | LED11.2-DOUT 11.36,27.76 11.36,33.17 11,33.53 LED12.4-DIN | LED12.4-DIN
N$11
  Top 0.254: LED12.2-DOUT 5.81,36.05 5.79,36.05 | 6.88,41.64 6.85,41.66 LED13.4-DIN
  Top 0.381: LED12.2-DOUT | LED12.2-DOUT 5.79,36.05 5.79,40.55 6.88,41.64 LED13.4-DIN | LED13.4-DIN
N$12  (1 unrouted)
  Top 0.254: 2.57,45.38 LED13.2-DOUT
  Top 0.381: LED13.2-DOUT 2.54,48.04 LED14.4-DIN
N$13
  Top 0.381: LED14.2-DOUT 5.73,59.23 LED15.4-DIN
N$14
  Top 0.381: LED15.2-DOUT 7,68.39 LED16.4-DIN
N$15
  Top 0.381: LED16.2-DOUT 10.01,75.98 LED17.4-DIN
N$16
  Top 0.381: LED17.2-DOUT 15.05,82.01 LED18.4-DIN
N$17
  Bottom 0.254: X2.A5 48.25,12.05 R15.1
N$18
  Bottom 0.254: R16.1 48.45,9.85 48.46,9.85 48.6,9.7 48.6,9.33 48.88,9.05 X2.B5
N$20
  Bottom 0.254: U3.30 58.4,31.25 C5.1
N$21
  Bottom 0.254: U4.10 46,15.65 C16.1
N$22
  Bottom 0.254: LED21.A 44,12.05 U4.6
N$23
  Bottom 0.381: R3.1 46.5,68.75 LED40.C
N$24
  Bottom 0.381: LED41.C 46.5,65.25 R4.1
N$25
  Bottom 0.381: R5.1 34.38,70.12 34.48,70.12 34.73,69.87 U2.1
N$26
  Bottom 0.381: R18.2 LED21.C
N$28
  Top 0.254: LED10.4-DIN 66.38,30.05 66.36,30.07 | 71.81,31.89 71.81,31.95 LED9.2-DOUT
  Top 0.381: LED10.4-DIN | LED10.4-DIN 66.36,30.07 68.18,31.89 71.81,31.89 LED9.2-DOUT | LED9.2-DOUT
N$32
  Bottom 0.381: R32.2 LED22.C
N$33
  Top 0.381: LED18.2-DOUT 27.55,87.21 LED19.4-DIN
NRST
  Bottom 0.254: U3.7 50.25,42 C18.1 50.15,43.65 R30.2
SCL  (via drill 0.35)
  Top 0.406: JP1.2 37.44,4.2 37.44,15.45 v28.2,24.69 | VL6.SCL 11,53.49 12.25,52.25 12.25,51.21 12.06,51.03 v12.06,49.19
  Bottom 0.381: VL5.SCL 67.69,53.04 67.69,54.78 67.28,55.19 67.28,59.7 66.92,60.58 67.28,61.45 VL4.SCL 66.24,63.97 65.36,64.33 65,65.2 61.4,68.8 VL3.SCL 60.84,73.17 59.1,73.17 56.45,75.82 55.24,75.82 53.31,77.75 53.31,78.26 VL2.SCL 50.8,79.31 49.92,78.94 49.05,79.31 43.96,79.31 VL1.SCL 39.96,80.69 38.22,80.69 37.81,80.28 33.3,80.28 32.42,79.92 31.55,80.28 VL9.SCL 29.03,79.24 28.67,78.36 27.8,78 24.2,74.4 21,74.4 | 21,74.4 VL8.SCL | R2.1 35.22,67.5 37.73,64.99 U2.22 37.73,62.73 36.12,61.12 U1.6 | VL6.SCL 13.69,56.96 13.69,62.05 14.06,62.92 13.69,63.8 VL7.SCL 14.74,66.31 15.61,66.67 15.97,67.55 19,70.58 19,71.27 19.83,72.1 19.83,73.23 21,74.4
  Bottom 0.406: v28.2,24.69 12.06,40.83 v12.06,49.19 20.31,49.19 21.14,48.37 25.33,48.37 34.91,57.95 U1.6
SDA  (via drill 0.35)
  Top 0.406: JP1.1 32.38,6.71 32.38,18.71 v27.3,23.79
  Bottom 0.254: 11,52 10.95,52.05 VL6.SDA
  Bottom 0.381: VL5.SDA 69,55.83 70.76,57.59 70.76,60.82 68.58,62.99 68.22,63.87 67.35,64.23 VL4.SDA 66.31,68.58 66.61,68.88 66.61,69.39 61.6,74.4 VL3.SDA 58.5,75.51 58.5,78 56.22,80.28 53.14,80.28 52.27,80.64 51.4,80.28 VL2.SDA 47.58,82.62 47.58,83.05 47.4,83.23 39.96,83.23 VL1.SDA 37.17,82 35.41,83.76 32.18,83.76 30.01,81.58 29.13,81.22 28.77,80.35 VL9.SDA 24.42,79.31 24.12,79.61 23.61,79.61 18.6,74.6 VL8.SDA 16.11,72.61 12.72,69.22 12.72,66.14 12.36,65.27 12.72,64.4 VL7.SDA 10.38,60.58 9.95,60.58 9,59.63 9,53.73 VL6.SDA | U2.23 37.08,64.92 36,66 35,66 34,65 R1.1 34.1,64.5 34.67,63.93 34.67,63.07 33.58,61.98 U1.5 28.26,53.84 21.14,53.84 20.26,52.96 13.03,52.96 12.07,52 11,52
  Bottom 0.406: v27.3,23.79 10.79,40.3 10.79,51.52 VL6.SDA
UART1-RX
  Bottom 0.254: U4.8 45,17.71 49.75,22.46 U3.43
UART1-TX
  Bottom 0.254: U4.9 45.5,17.5 50.25,22.25 U3.42
UART2-RX
  Bottom 0.254: TP9.TP 60.32,44.11 59.05,42.84 59.05,39.03 57.77,37.75 U3.17
UART4-RX
  Bottom 0.254: U3.15 54.25,42.26 51.11,45.4 45.89,45.4 42,49.29 42,55.83 U1.7
UART5-RX  (via drill 0.35)  (1 unrouted)
  Top 0.254: 40,29.12 40.67,28.45 42.85,28.45 43.29,28.89 43.29,31.1 v43.79,31.6 44.16,31.96 v44.16,41.57
  Bottom 0.254: U3.54 44.6,32.75 44.02,32.16 44.02,31.82 v43.79,31.6 | v44.16,41.57 40.09,41.57 U1.8
UART5-TX  (via drill 0.35)
  Top 0.254: v44,31 43.68,30.68 43.68,28.73 43.01,28.07 39.87,28.07 TP4.TP
  Bottom 0.254: U3.53 44.64,32.25 44.4,32.01 44.4,31.4 v44,31
VBUS
  Bottom 0.254: X2.A4B9 49.71,12.94 50.14,12.94 50.67,12.41 50.67,9.19 50.14,8.66 49.71,8.66 X2.B4A9
VDD  (via drill 0.35)
  Top 0.381: TP1.TP 42.54,31.22 43.59,32.27 43.59,49.59 v44,50
  Bottom 0.381: D1.K 44.23,52.72 45.35,52.72 | 45.35,52.72 REG1.1 49.48,52.72 C4.+ | 45.35,52.72 C2.1 45,51 v44,50
X1
  Bottom 0.254: U2.6 39.62,69.95 39.62,72.14 37.81,73.95 37.81,76.24 39.43,77.86 R6.2
  Bottom 0.381: R6.2 39.88,78.38 39.88,78.48 40.86,79.46 VL1.X
X2  (via drill 0.3)
  Top 0.254: v43.05,68.72 51.24,76.91 VL2.X
  Bottom 0.254: v43.05,68.72 39.43,68.72 39.05,69.1 39.05,69.86 U2.5
  Bottom 0.381: R7.2 49.34,76.29 49.74,76.69 51.03,76.69 VL2.X
X3  (via drill 0.3)
  Top 0.254: v43.05,68.05 52,68.05 54.86,70.91 v56.48,70.91
  Bottom 0.254: v43.05,68.05 39.52,68.05 38.38,69.19 U2.4 | v56.48,70.91 57.24,70.91 R8.2
  Bottom 0.381: R8.2 57.87,71.03 57.94,71.1 59.32,71.1 VL3.X
X4  (via drill 0.3)
  Top 0.254: v42.95,60.72 42.95,60.91 43.91,61.86 64.86,61.86 VL4.X
  Bottom 0.254: v42.95,60.72 41.05,60.72 39.05,62.72 39.05,64.05 U2.20
  Bottom 0.381: R9.2 63.81,63.03 63.89,62.99 VL4.X
X5  (via drill 0.3)
  Top 0.254: v44.1,61.29 58.67,61.29 65.24,54.71 65.24,52.91 66.38,51.76 VL5.X
  Bottom 0.254: R10.2 66.46,49.9 VL5.X | v44.1,61.29 41.05,61.29 39.71,62.62 39.71,64.05 U2.19
X6  (via drill 0.3)
  Top 0.254: v40.29,62.81 22.09,62.81 13.62,54.33 VL6.X
  Bottom 0.254: v40.29,62.81 40.29,64.05 U2.18
  Bottom 0.381: VL6.X 13.54,56.09 14.2,56.75 14.2,57.93 R11.2
X7  (via drill 0.3)
  Top 0.254: v40.57,65.29 17.05,65.29 16.09,64.34 VL7.X
  Bottom 0.254: v40.57,65.29 40.95,64.91 40.95,64.14 U2.17
  Bottom 0.381: R12.2 16.71,62.34 16.31,62.74 16.31,64.03 VL7.X
X8  (via drill 0.3)
  Top 0.254: v39.71,66.91 27.81,66.91 22.19,72.53 VL8.X
  Bottom 0.254: v39.71,66.91 41.62,65 41.62,64.14 U2.16
  Bottom 0.381: R13.2 21.97,70.86 21.9,70.94 21.9,72.32 VL8.X
X9  (via drill 0.3)
  Top 0.254: v41.91,66.91 41.91,67.1 31.14,77.86 VL9.X
  Bottom 0.254: v41.91,66.91 42.19,66.62 42.19,64.14 U2.15
  Bottom 0.381: R14.2 30.14,76.08 30.14,76.64 31.05,77.55 VL9.X

### Text on the board
tNames: /Users/shirokuma89dev/Downloads/アートボード 1@4x.bmp
200bmp: /Users/shirokuma89dev/Downloads/アートボード 2@4x (1).bmp